# Altium project EWEMOS.PrjPcb
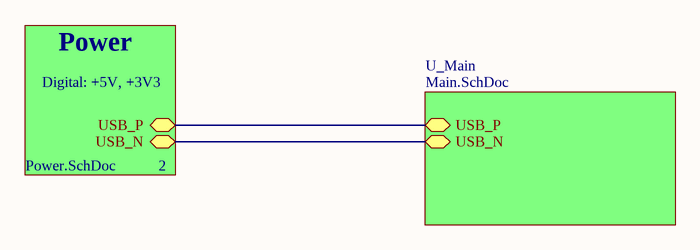
[diagram p0: Overview.SchDoc]
3 sheets, 39 parts. Net scope: hierarchical (ports join the sheet entries above them; power ports are global).
Board file: PCB.PcbDoc
Sheets:
  Overview.SchDoc
    U_Main = Main.SchDoc
    Power = Power.SchDoc

## Sheet Overview.SchDoc: EWEMOS [1] Overview
size B; Author: Vojtěch Horčička; DrawnBy: Vojtěch Horčička; SheetNumber: 1; SheetTotal: 3

### Sub-sheets
Power = Power.SchDoc: USB_N (bidir), USB_P (bidir)
U_Main = Main.SchDoc: USB_P (bidir), USB_N (bidir)

### Nets
USB_N: sheet U_Main/USB_N, sheet Power/USB_N
USB_P: sheet U_Main/USB_P, sheet Power/USB_P

### Notes on the sheet
- Digital: +5V, +3V3
- Power
- 2

## Sheet Main.SchDoc
size B; SheetNumber: 3; SheetTotal: 3
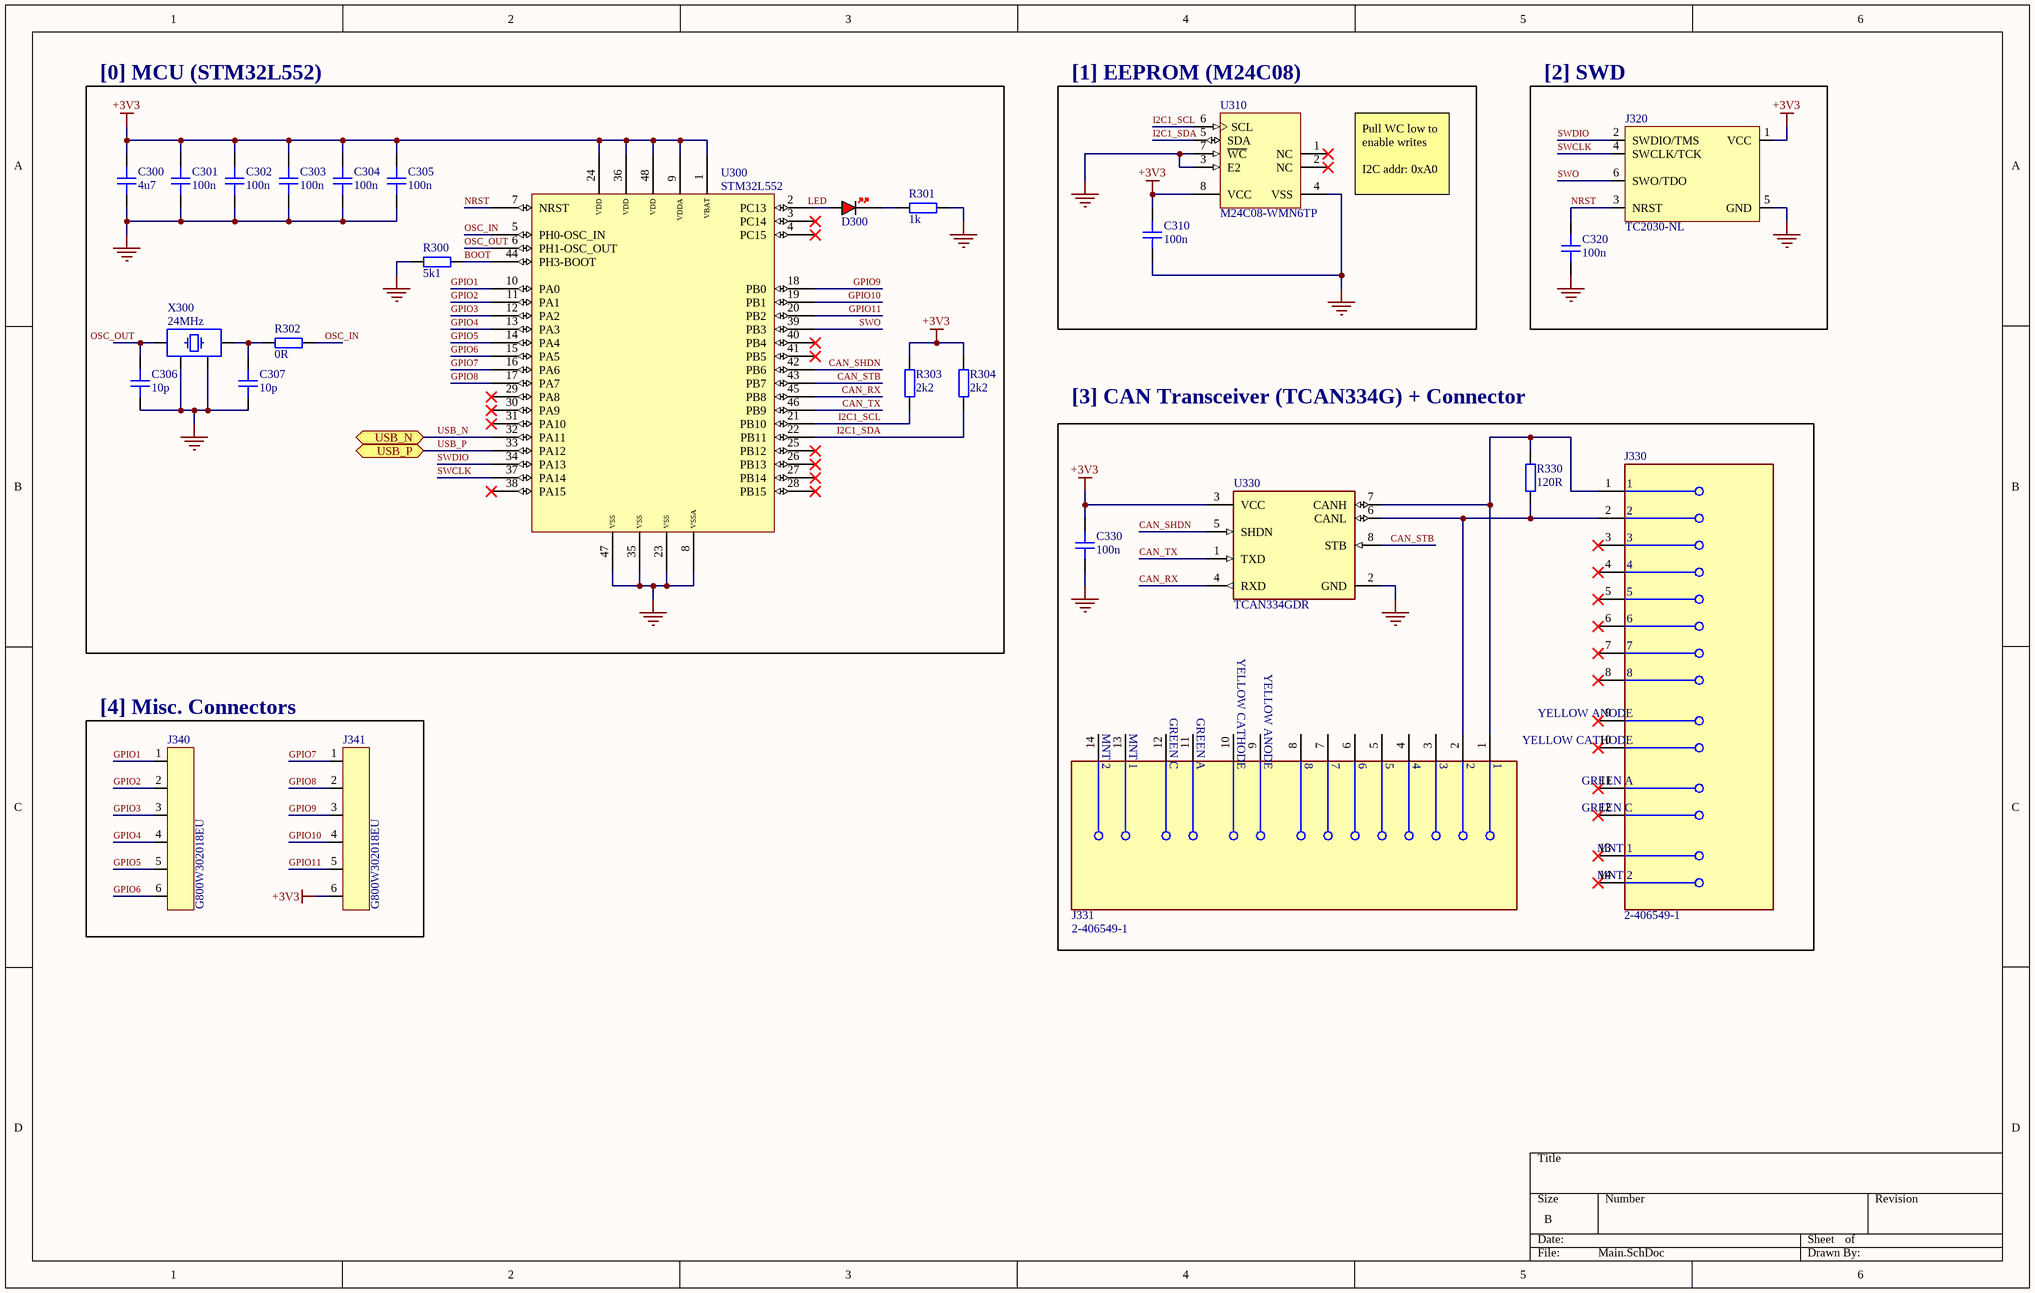
[diagram p1: Main.SchDoc]

### Parts
C300  4u7  [CAP_0805]
C301  100n  [CAP_0603]
C302  100n  [CAP_0603]
C303  100n  [CAP_0603]
C304  100n  [CAP_0603]
C305  100n  [CAP_0603]
C306  10p  [CAP_0603]
C307  10p  [CAP_0603]
C310  100n  [CAP_0603]
C320  100n  [CAP_0603]
C330  100n  [CAP_0603]
D300  RED  [LED_0603_RED]  (value not drawn)
J320  TC2030-NL  [TC2030-NL-FP]  (no BOM)
J330  2-406549-1  [FP-2-406549-1-MFG]
J331  2-406549-1  [FP-2-406549-1-MFG]
J340  G800W302018EU  [G800W302018EU]
J341  G800W302018EU  [G800W302018EU]
R300  5k1  [RES_0603]
R301  1k  [RES_0603]
R302  0R  [RES_0603]
R303  2k2  [RES_0603]
R304  2k2  [RES_0603]
R330  120R  [RES_0603]
U300  STM32L552  [LQFP48]
U310  M24C08-WMN6TP  [STM-SOIC-8_L]
U330  TCAN334GDR  [FP-D0008A-IPC_B]
X300  24MHz  [XTAL_3225]

### Blocks framed on the sheet
[0] MCU (STM32L552): C300-C307 D300 R300-R304 U300 X300
[1] EEPROM (M24C08): C310 U310
[2] SWD: C320 J320
[3] CAN Transceiver (TCAN334G) + Connector: C330 J330 J331 R330 U330
[4] Misc. Connectors: J340 J341

### Ports
USB_N (bidir, see Overview[3B], Power[4A]), USB_P (bidir, see Overview[3B], Power[4B])

### Nets
+3V3: C300.2 C301.2 C302.2 C303.2 C304.2 C305.2 C310.1 C330.2 J320.1(VCC) J341.6 R303.2 R304.2 U300.1(VBAT) U300.9(VDDA) U300.24(VDD) U300.36(VDD) U300.48(VDD) U310.8(VCC) U330.3(VCC)
GND: C300.1 C301.1 C302.1 C303.1 C304.1 C305.1 C306.2 C307.1 C310.2 C320.1 C330.1 J320.5(GND) R300.2 R301.2 U300.8(VSSA) U300.23(VSS) U300.35(VSS) U300.47(VSS) U310.3(E2) U310.4(VSS) U310.7(~{WC}) U330.2(GND) X300.2 X300.4
BOOT: R300.1 U300.44(PH3-BOOT)
CAN_RX: U300.45(PB8) U330.4(RXD)
CAN_SHDN: U300.42(PB6) U330.5(SHDN)
CAN_STB: U300.43(PB7) U330.8(STB)
CAN_TX: U300.46(PB9) U330.1(TXD)
GPIO1: J340.1 U300.10(PA0)
GPIO2: J340.2 U300.11(PA1)
GPIO3: J340.3 U300.12(PA2)
GPIO4: J340.4 U300.13(PA3)
GPIO5: J340.5 U300.14(PA4)
GPIO6: J340.6 U300.15(PA5)
GPIO7: J341.1 U300.16(PA6)
GPIO8: J341.2 U300.17(PA7)
GPIO9: J341.3 U300.18(PB0)
GPIO10: J341.4 U300.19(PB1)
GPIO11: J341.5 U300.20(PB2)
I2C1_SCL: R303.1 U300.21(PB10) U310.6(SCL)
I2C1_SDA: R304.1 U300.22(PB11) U310.5(SDA)
LED: D300.A U300.2(PC13)
NRST: C320.2 J320.3(NRST) U300.7(NRST)
OSC_IN: R302.1 U300.5(PH0-OSC_IN)
OSC_OUT: C306.1 U300.6(PH1-OSC_OUT) X300.1
SWCLK: J320.4(SWCLK/TCK) U300.37(PA14)
SWDIO: J320.2(SWDIO/TMS) U300.34(PA13)
SWO: J320.6(SWO/TDO) U300.39(PB3)
USB_N: U300.32(PA11) ; port USB_N
USB_P: U300.33(PA12) ; port USB_P
NetC307_2: C307.2 R302.2 X300.3
NetD300_K: D300.K R301.1
NetJ330_1: J330.1 J331.1 R330.2 U330.7(CANH)
NetJ330_2: J330.2 J331.2 R330.1 U330.6(CANL)

Not connected (* = marked no-connect by the designer): J330 3* 4* 5* 6* 7* 8* 9(YELLOW_ANODE)* 10(YELLOW_CATHODE)* 11(GREEN_A)* 12(GREEN_C)* 13(MNT_1)* 14(MNT_2)*; J331 3 4 5 6 7 8 9(YELLOW_ANODE) 10(YELLOW_CATHODE) 11(GREEN_A) 12(GREEN_C) 13(MNT_1) 14(MNT_2); U300 3(PC14)* 4(PC15)* 25(PB12)* 26(PB13)* 27(PB14)* 28(PB15)* 29(PA8)* 30(PA9)* 31(PA10)* 38(PA15)* 40(PB4)* 41(PB5)*; U310 1(NC)* 2(NC)*

### Notes on the sheet
- Pull WC low to enable writes
  I2C addr: 0xA0

### Library data of the parts
C300 = CAP_0805_16V: Capacitor SMD 0805 16V
C301-C307 C310 C320 C330 = CAP_0603_16V: Capacitor SMD 0603 16V
D300 = LED_0603_RED: LED 0603 RED SMD
J320 = TC2030-NL: Tag-Connect No-Solder SWD Debug Connector (No Legs) DO NOT PLACE; Manufacturer: Tag-Connect; Manufacturer Part Number: TC2030-NL-FP
J330 J331 = CMP-2000-05541-2: CONN MOD JACK 8P8C R/A SHIELDED; Max Voltage Rating (AC): 150V; Number of Contacts: 8; PCB Mounting Orientation: Right Angle; Direction: Up; Pitch: 2.03mm; Number of Ports: 1; Gender: Female; Tail Length: 2.54mm; Current Rating: 1.5A; Keyed: No; Approvals: UL; PCB Thickness: 1.57mm; Element Configuration: Single; Connector Type: Jack; Color: Yellow; Max Operating Temperature: 85°C; Weight: 0.144729oz; Series: -; Orientation: Right Angle; Width: 17.27mm; Package Quantity: 63; Mount: Panel; Contact Plating: Gold; Length: 17.86mm; Depth: 15.75mm; Flammability Rating: UL94 V-0; Shielding: Shielded; Housing Material: Thermoplastic; Number of Positions Loaded: 8; Contact Material: Bronze; Voltage Rating: 150V; Packaging: Tray; Number of Positions: 8; Termination: Solder; Number of Rows: 1; Radiation Hardening: No; Min Operating Temperature: -40°C; RoHS Compliant: Yes; Housing Color: Black
J340 J341 = G800W302018EU: Pin Header 6 Position 2.54mm Pitch; Manufacturer: Amphenol; Manufacturer Part Number: G800W302018EU
R300-R304 R330 = RES_0603: Resistor SMD 0603; Manufacturer: *; Manufacturer Part Number: *; Distributor Link: *
U300 = STM32L552: STM32L552 MCU LQFP-48
U310 = CMP-2000-06639-1: I2C Bus EEPROM, 8 Kbits, 2.5 to 5.5 V, -40 to 85 degC, 8-Pin SOIC, RoHS, Tape and Reel; Manufacturer: STMicroelectronics; Frequency: 0.4MHz; Access Time (Max): 900ns; Write Protection: Yes; Density: 8192Bit; Operating Supply Voltage (Min): 2.5V; Organization: 1Kx8; Rad Hardened: No; Data Retention: 40; Supply Current: 2mA; Operating Supply Voltage (Typ): 3.3/5V; Operating Supply Voltage (Max): 5.5V; Interface Type: Serial(I2C); DELETED: Compliant; Package Description: 8-Pin Small Outline Integrated Circuit, Body 4.9 x 3.9 mm, Pitch 1.27 mm; Operating Temperature Classification: Industrial; Datasheet Version: Rev. 4, 06/2014; Datasheet URL: http://www.st.com/content/ccc/resource/technical/document/datasheet/cc/f5/a5/01/6f/4b/47/d2/DM00070057.pdf/files/DM00070057.pdf/jcr:content/translations/en.DM00070057.pdf; Packaging: TapeandReel; Operating Temperature (Min): -40C; Package Type: SOICN; Operating Temp Range: -40Cto85C; Frequency (Max): 0.4MHz; Mounting Technology: SurfaceMount; Operating Temperature (Max): 85C; Manufacturer URL: http://www.st.com/; Programmable: Yes; Package Reference: SOIC-8; Mounting: SurfaceMount; Pin Count: 8
U330 = CMP-04872-000213-1: IC TRANSCEIVER 1/1 8SOIC; Receiver Hysteresis: 120mV; Data Rate: 1Mbps; Mount: Surface Mount; Lead Free: Lead Free; Max Operating Temperature: 125°C; Case/Package: SOIC; RoHS Compliant: Yes; Packaging: Tape and Reel; Min Operating Temperature: -40°C
X300 = TSX-3225_24.0000MF15X-AC: Crystal SMD 24MHz 10PPM 7pF 3225; Manufacturer: Epson; Manufacturer Number: TSX-3225 24.0000MF15X-AC; ESR: 40R; Value: 24MHz; Type: XTAL; Load Capacitance: 7pF

## Sheet Power.SchDoc
size 254 x 190 mm; SheetNumber: 2; SheetTotal: 3
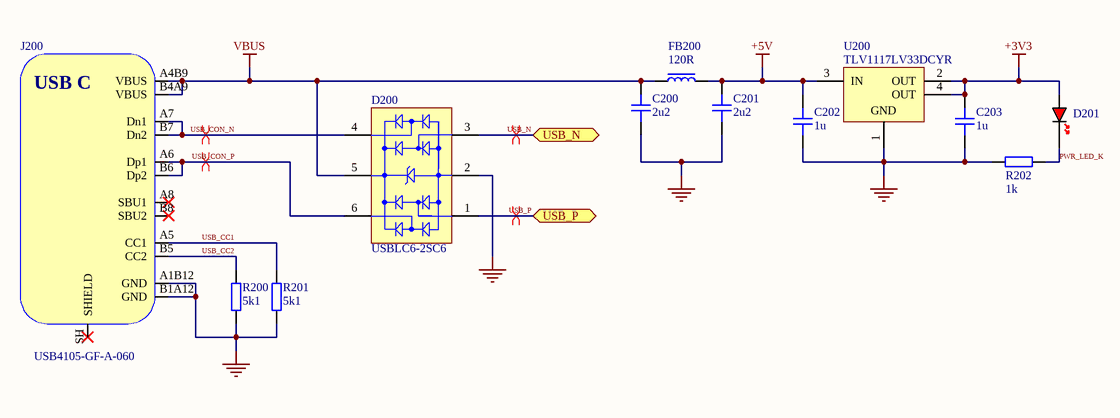
[diagram p2: Power.SchDoc]

### Parts
C200  2u2  [CAP_0805]
C201  2u2  [CAP_0805]
C202  1u  [CAP_0805]
C203  1u  [CAP_0805]
D200  USBLC6-2SC6  [STM-SOT23-6L_V]
D201  RED  [LED_0603_RED]  (value not drawn)
FB200  120R  [FB_0603]
J200  USB4105-GF-A-060  [USB4105-GF-A-060]
R200  5k1  [RES_0603]
R201  5k1  [RES_0603]
R202  1k  [RES_0603]
U200  TLV1117LV33DCYR  [DCY0004A_N]

### Ports
USB_N (bidir, see Overview[2B], Main[2B]), USB_P (bidir, see Overview[2B], Main[2B])

### Nets
+3V3: C203.1 D201.A U200.2(OUT) U200.4(OUT)
+5V: C201.1 C202.1 FB200.2 U200.3(IN)
GND: C200.1 C201.2 C202.2 C203.2 D200.2(GND) J200.A1B12(GND) J200.B1A12(GND) R200.1 R201.1 R202.2 U200.1(GND)
VBUS: C200.2 D200.5(VBUS) FB200.1 J200.A4B9(VBUS) J200.B4A9(VBUS)
PWR_LED_K: D201.K R202.1
USB_CC1: J200.A5(CC1) R201.2
USB_CC2: J200.B5(CC2) R200.2
USB_CON_N: D200.4(I/O_3) J200.A7(Dn1) J200.B7(Dn2)
USB_CON_P: D200.6(I/O_4) J200.A6(Dp1) J200.B6(Dp2)
USB_N: D200.3(I/O_2) ; port USB_N
USB_P: D200.1(I/O_1) ; port USB_P

Not connected (* = marked no-connect by the designer): J200 A8(SBU1)* B8(SBU2)* SH(SHIELD)*

### Layout directives
differential pair; differential pair class DIFF_USB_CON: USB_CON_N, USB_CON_P
differential pair; differential pair class DIFF_USB: USB_N, USB_P

### Notes on the sheet
- (in symbol USB4105-GF-A-060) USB C

### Library data of the parts
C200-C203 = CAP_0805_16V: Capacitor SMD 0805 16V
D200 = CMP-2000-05378-1: Very low capacitance ESD protection, 3.5 pF, -40 to 125 degC, 6-Pin SOT23, RoHS, Tape and Reel; Manufacturer: STMicroelectronics; Polarity: Uni-Directional; Clamping Voltage: 17V; Rad Hardened: No; Product Height (mm): 1.3mm; Leakage Current (Max): 0.15uA; Product Length (mm): 3.05mm; Number of Elements: 1; Peak Pulse Current: 5A; Configuration: Dual; Reverse Breakdown Voltage: 6V; Working Voltage (Max): 5V; Capacitance Value: 3.5pF; Suppressor Type: DiodeArrays; Product Depth (mm): 1.75mm; Test Current (It): 1mA; Package / Case: SOT-23; Operating Temperature Max Deg. C: 125C; Package Description: 6-Pin Small Outline Transistor, Body 2.925 x 1.625 mm, Pitch 0.95 mm; Package Reference: SOT23-6L; Datasheet Version: Rev. 5, 10/2011; Operating Temperature Min Deg. C: -40C; Mounting Style: SurfaceMount; Direction Type: Uni-Directional; Mounting: SurfaceMount; Pin Count: 6; Leakage Current: 0.15uA; Packaging: TapeandReel; Operating Temperature Classification: Automotive; Clamping Voltage (Max): 17V; Manufacturer URL: http://www.st.com/; Reverse Stand-off Voltage: 5V; Datasheet URL: http://www.st.com/st-web-ui/static/active/en/resource/technical/document/datasheet/CD00050750.pdf; Working Voltage: 5V; Operating Temp Range: -40Cto125C
D201 = LED_0603_RED: LED 0603 RED SMD
FB200 = FB_0603: Ferrite Bead SMD 0603
J200 = USB4105-GF-A-060: USB Connector Type C SMT 12 Pin; Manufacturer: GCT; Manufacturer Part Number: USB4105-GF-A-060
R200-R202 = RES_0603: Resistor SMD 0603; Manufacturer: *; Manufacturer Part Number: *; Distributor Link: *
U200 = CMP-0395-00503-2: Single Output LDO, 1 A, Fixed 3.3 V Output, 2 to 5.5 V Input, 4-pin SOT-223 (DCY), -40 to 125 degC, Green (RoHS & no Sb/Br); Manufacturer: Texas Instruments; Vout Adj(Min)(V): 3.3; Vdo(Typ)(mV): 1200; Iq(Typ)(mA): 0.05; Accuracy(%): 2; Iout(Max)(A): 1; SubFamily: Single Channel LDO; Vin(Max)(V): 5.5; PackageReference: DCY0004A; PackageDescription: 4-Pin Plastic Small Outline, Body 3.5 x 6.5 mm, Pitch 2.3 mm; Vout Adj(Max)(V): 3.3; Mounting Technology: Surface Mount; ComponentLink2Description: Datasheet; ComponentLink1Description: Manufacturer URL; PartNumber: TLV1117LV33DCYR; ComponentLink3Description: Package Specification; ComponentLink1URL: http://www.ti.com/; ComponentLink2URL: http://www.ti.com/general/docs/lit/getliterature.tsp?genericPartNumber=TLV1117LV33&fileType=pdf; Fixed Output Options(V): 3.3; PackageVersion: 4202506/B; Vin(Min)(V): 2; DatasheetVersion: SBVS160A; Eco-Plan: Green (RoHS & no Sb/Br); ComponentLink3URL: http://www.ti.com/litv/pdf/mpds094a; Code_JEDEC: TO-261

## Nets that join several sheets
+3V3: Main (19 pins), Power (C203.1 D201.A U200.2 U200.4)
GND: Main (24 pins), Power (11 pins)
USB_N: Main (U300.32), Power (D200.3)
USB_P: Main (U300.33), Power (D200.1)